# Altium schematic sheet Cama caliente.SchDoc
size A4
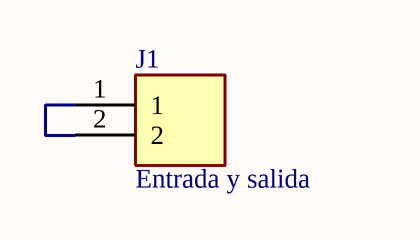
[diagram p0: Cama caliente.SchDoc]

## Parts
J1  Comment_1: Entrada y salida  [TE_282841-2]  (hidden comment: 282841-2)

## Nets
NetJ1_1: J1.1 J1.2

## Library data of the parts
J1 = 282841-2: Conn Terminal Block 2 POS 5.08mm Solder ST Thru-Hole 17.5A/Contact; MF: TE Connectivity; SnapEDA_Link: https://www.snapeda.com/parts/282841-2/TE%20Connectivity%20AMP%20Connectors/view-part/434231/?ref=snap; Availability: Unavailable; TE_purchase_URL: https://www.te.com/usa-en/product-282841-2.html?te_bu=Cor&te_type=disp&te_campaign=seda_glo_cor-seda-global-disp-prtnr-fy19-seda-model-bom-cta_sma-317_1&elqCampaignId=32493; Value: *; EU_RoHS_Compliance: Compliant with Exemptions; Price: None; MP: 282841-2; Package: None